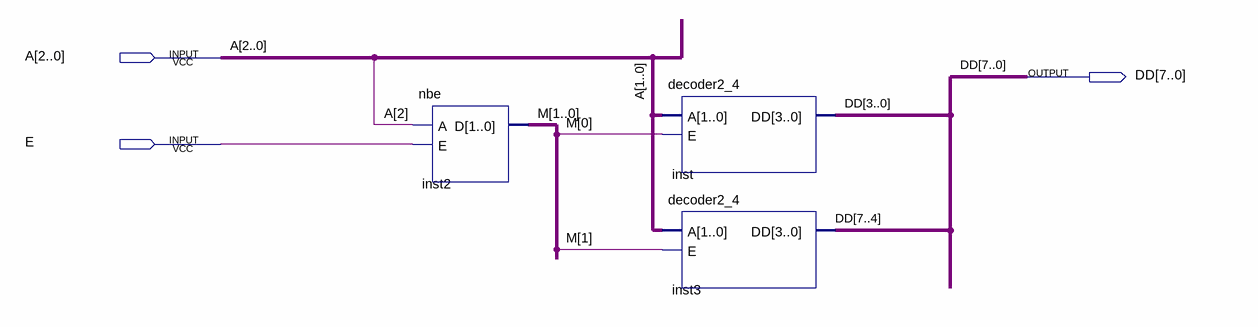
[diagram p0: schematic sheet]
// Quartus schematic decoder3_8.bdf as structural Verilog: 3 symbols, 3 pins
module decoder3_8 (
  input  [2:0] A,
  input  E,
  output [7:0] DD
);

  wire [1:0] M;

  nbe inst2 (.A(A[2]), .E(E), .D(M));
  decoder2_4 inst (.A(A[1:0]), .E(M[0]), .DD(DD[3:0]));
  decoder2_4 inst3 (.A(A[1:0]), .E(M[1]), .DD(DD[7:4]));
endmodule
